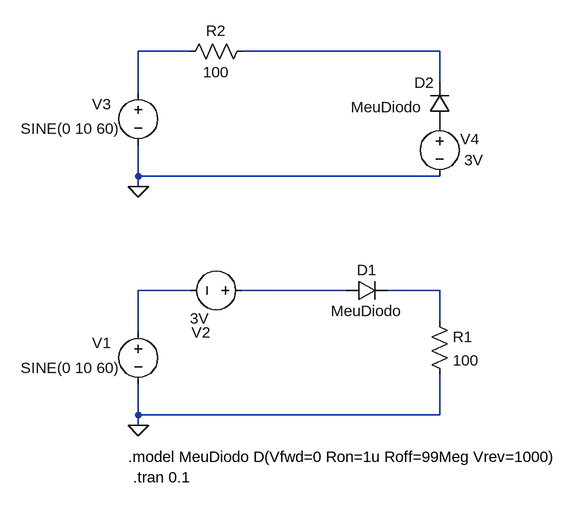
[diagram p0: schematic Diodo-Ceifador-LTSpice.asc]
Diodo-Ceifador-LTSpice.asc, the LTspice schematic file:
Version 4
SHEET 1 880 680
WIRE 64 -336 -16 -336
WIRE 448 -336 144 -336
WIRE 448 -288 448 -336
WIRE -16 -272 -16 -336
WIRE -16 -144 -16 -192
WIRE 448 -144 -16 -144
WIRE -16 -128 -16 -144
WIRE 64 32 -16 32
WIRE 304 32 144 32
WIRE 448 32 368 32
WIRE 448 80 448 32
WIRE -16 96 -16 32
WIRE -16 224 -16 176
WIRE 448 224 448 160
WIRE 448 224 -16 224
WIRE -16 240 -16 224
FLAG -16 240 0
FLAG -16 -128 0
SYMBOL voltage -16 80 R0
WINDOW 123 0 0 Left 2
WINDOW 39 0 0 Left 2
WINDOW 0 -71 33 Left 2
WINDOW 3 -181 71 Left 2
SYMATTR InstName V1
SYMATTR Value SINE(0 10 60)
SYMBOL voltage 160 32 R90
WINDOW 123 0 0 Left 2
WINDOW 39 0 0 Left 2
WINDOW 0 65 65 VRight 2
WINDOW 3 43 67 VRight 2
SYMATTR InstName V2
SYMATTR Value 3V
SYMBOL res 432 64 R0
SYMATTR InstName R1
SYMATTR Value 100
SYMBOL diode 304 48 R270
WINDOW 0 32 32 VTop 2
WINDOW 3 0 32 VBottom 2
SYMATTR InstName D1
SYMATTR Value MeuDiodo
SYMBOL voltage -16 -288 R0
WINDOW 123 0 0 Left 2
WINDOW 39 0 0 Left 2
WINDOW 0 -71 33 Left 2
WINDOW 3 -181 71 Left 2
SYMATTR InstName V3
SYMATTR Value SINE(0 10 60)
SYMBOL voltage 448 -240 R0
WINDOW 123 0 0 Left 2
WINDOW 39 0 0 Left 2
WINDOW 0 61 39 Right 2
WINDOW 3 67 71 Right 2
SYMATTR InstName V4
SYMATTR Value 3V
SYMBOL res 160 -352 R90
WINDOW 0 0 56 VBottom 2
WINDOW 3 32 56 VTop 2
SYMATTR InstName R2
SYMATTR Value 100
SYMBOL diode 464 -224 R180
WINDOW 0 24 64 Left 2
WINDOW 3 42 26 Left 2
SYMATTR InstName D2
SYMATTR Value MeuDiodo
TEXT -24 320 Left 2 !.tran 0.1
TEXT -32 288 Left 2 !.model MeuDiodo D(Vfwd=0 Ron=1u Roff=99Meg Vrev=1000)

The netlist it stands for:
* Diodo-Ceifador-LTSpice.asc
V1 N003 0 SINE(0 10 60)
V2 N004 N003 3V
R1 N005 0 100
D1 N004 N005 MeuDiodo
V3 N001 0 SINE(0 10 60)
V4 P001 0 3V
R2 N002 N001 100
D2 P001 N002 MeuDiodo
.model D D
.lib standard.dio
.tran 0.1
.model MeuDiodo D(Vfwd=0 Ron=1u Roff=99Meg Vrev=1000)
.backanno
.end